# Altium schematic sheet CableNew REV2.0.SchDoc
size A4
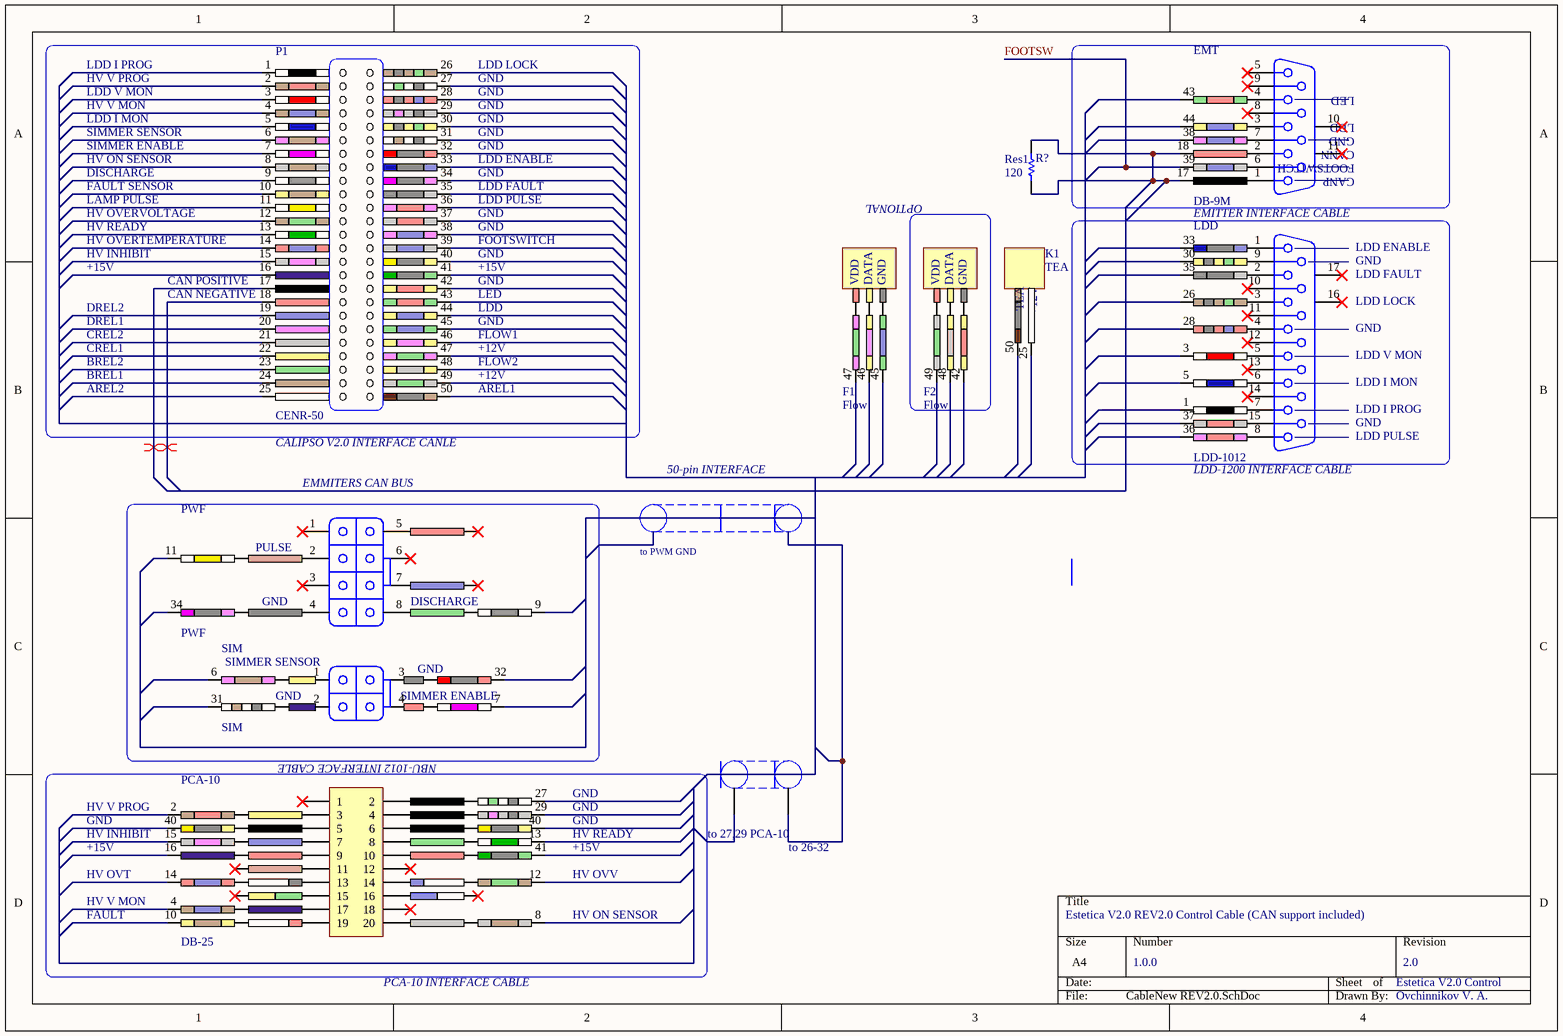
[diagram p0: CableNew REV2.0.SchDoc]

## Parts
EMT  DB-9M
F1  Flow
F2  Flow
K1  TEA
LDD  LDD-1012
P1  CENR-50
PCA-10  DB-25
PWF  PWF
R?  Res1  value 120  [AXIAL-0.3]
SIM  SIM

## Blocks framed on the sheet
OPTIONAL: F2

## Nets
NetEMT_17: EMT.17 EMT.18 R?.1 R?.2

Not connected (* = marked no-connect by the designer): EMT 1 2 3 4 5* 6 7 8* 9* 10(MH1)* 11(MH2)* 38 39 43 44; F1 45 46 47; F2 42 48 49; K1 25 50; LDD 1 2 3 4 5 6 7 8 9 10* 11* 12* 13* 14* 15 16(MH1)* 17(MH2)* 26 28 30 33 35 36 37; P1 1 2 3 4 5 6 7 8 9 10 11 12 13 14 15 16 17 18 19 20 21 22 23 24 25 26 27 28 29 30 31 32 33 34 35 36 37 38 39 40 41 42 43 44 45 46 47 48 49 50; PCA-10 1* 2 3 4 5 6 7 8 9 10 11 12* 13 14 15 16 17 18* 19 20 27 29 40 41 ?1 ?2 ?3 ?4 ?5 ?6 ?7 ?8 ?9 ?10 ?11 ?12 ?13 ?14 ?15* ?16* ?17*; PWF 1* 2 3* 4 5 6* 7 8 9 11 34 ?1 ?2 ?3* ?4* ?5; SIM 1 2 3 4 6 7 31 32 ?1 ?2 ?3 ?4

## Layout directives
differential pair: NetP1_17, NetP1_18

## Notes on the sheet
- HV V MON
- LDD V MON
- HV V PROG
- LDD I PROG
- (near P1) GND
- (near P1) LDD LOCK
- DISCHARGE
- HV ON SENSOR
- SIMMER ENABLE
- SIMMER SENSOR
- LDD I MON
- (near P1) LDD ENABLE
- HV OVERTEMPERATURE
- HV READY
- HV OVERVOLTAGE
- LAMP PULSE
- FAULT SENSOR
- (near P1) FOOTSWITCH
- (near P1) LDD PULSE
- (near P1) LDD FAULT
- EMITTER INTERFACE CABLE
- (near LDD) LDD ENABLE
- DREL2
- HV INHIBIT
- +15V
- (near P1) CAN POSITIVE
- (near P1) CAN NEGATIVE
- (near P1) LDD
- (near P1) LED
- (near P1) +15V
- (near LDD) GND
- (near LDD) LDD FAULT
- (near LDD) LDD LOCK
- BREL1
- BREL2
- CREL1
- CREL2
- DREL1
- (near P1) +12V
- (near P1) FLOW2
- (near P1) FLOW1
- (near LDD) LDD V MON
- (near LDD) LDD I MON
- AREL2
- (near P1) CALIPSO V2.0 INTERFACE CANLE
- (near P1) AREL1
- (near LDD) LDD I PROG
- (near LDD) LDD PULSE
- (near PWF) EMMITERS CAN BUS
- 50-pin INTERFACE
- (near LDD) LDD-1200 INTERFACE CABLE
- to PWM GND
- (near PCA-10) NBU-1012 INTERFACE CABLE
- (near PCA-10) HV V PROG
- GND
- (near PCA-10) HV INHIBIT
- (near PCA-10) GND
- (near PCA-10) HV READY
- (near PCA-10) +15V
- to 27,29 PCA-10
- to 26-32
- HV OVT
- (near PCA-10) HV V MON
- FAULT
- (near PCA-10) HV OVV
- (near PCA-10) HV ON SENSOR
- Estetica V2.0 REV2.0 Control Cable (CAN support included)
- PCA-10 INTERFACE CABLE
- 1.0.0
- Estetica V2.0 Control
- 2.0
- Ovchinnikov V. A.
- (in symbol Emmiter) LED; LDD; GND; CANN; FOOTSWITCH; CANP
- (in symbol Flow Sensor) VDD; DATA; GND
- (in symbol Flow Sensor 2) VDD; DATA; GND
- (in symbol PWF) PULSE; GND; DISCHARGE
- (in symbol SIM) SIMMER SENSOR; GND; SIMMER ENABLE
- (in symbol TEA) +12V

## Library data of the parts
EMT = Emmiter
F1 = Flow Sensor
F2 = Flow Sensor 2
K1 = TEA: Termo electrical assembly
P1 = CENR50: Laser Interface Cable
PCA-10 = PCA-10-NEW
R? = Res1: Resistor; Published: 8-Jun-2000; LatestRevisionDate: 17-Jul-2002; LatestRevisionNote: Re-released for DXP Platform.; PackageReference: AXIAL-0.3; Publisher: Altium Limited; PackageDescription: Axial Device, Thru-Hole; 2 Leads; 0.3 in Pin Spacing